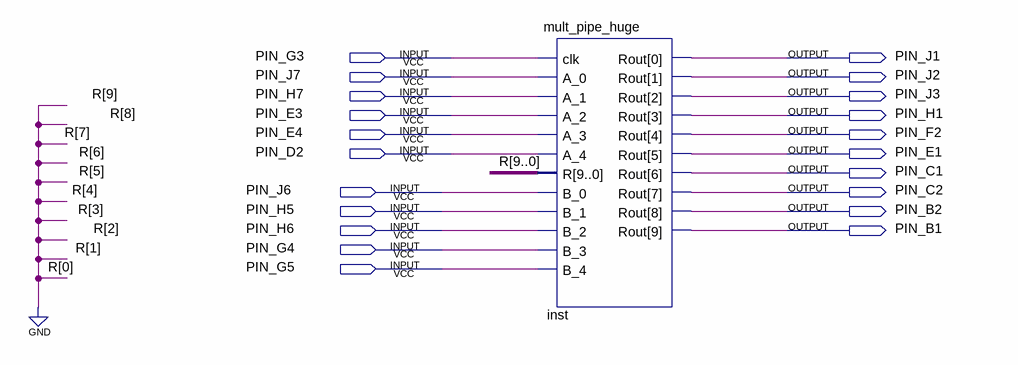
[diagram p0: schematic sheet]
// Quartus schematic mult_pipe.bdf as structural Verilog: 1 symbols, 21 pins
module mult_pipe (
  input  PIN_G3,
  input  PIN_J7,
  input  PIN_H7,
  input  PIN_E3,
  input  PIN_E4,
  input  PIN_D2,
  input  PIN_J6,
  input  PIN_H5,
  input  PIN_H6,
  input  PIN_G4,
  input  PIN_G5,
  output PIN_J1,
  output PIN_J2,
  output PIN_J3,
  output PIN_H1,
  output PIN_F2,
  output PIN_E1,
  output PIN_C1,
  output PIN_C2,
  output PIN_B2,
  output PIN_B1
);

  mult_pipe_huge inst (
    .clk(PIN_G3), .A_0(PIN_J7), .A_1(PIN_H7), .A_2(PIN_E3), .A_3(PIN_E4), .A_4(PIN_D2), .R({10{1'b0}}),
    .B_0(PIN_J6), .B_1(PIN_H5), .B_2(PIN_H6), .B_3(PIN_G4), .B_4(PIN_G5),
    .Rout({PIN_B1, PIN_B2, PIN_C2, PIN_C1, PIN_E1, PIN_F2, PIN_H1, PIN_J3, PIN_J2, PIN_J1}));
endmodule
